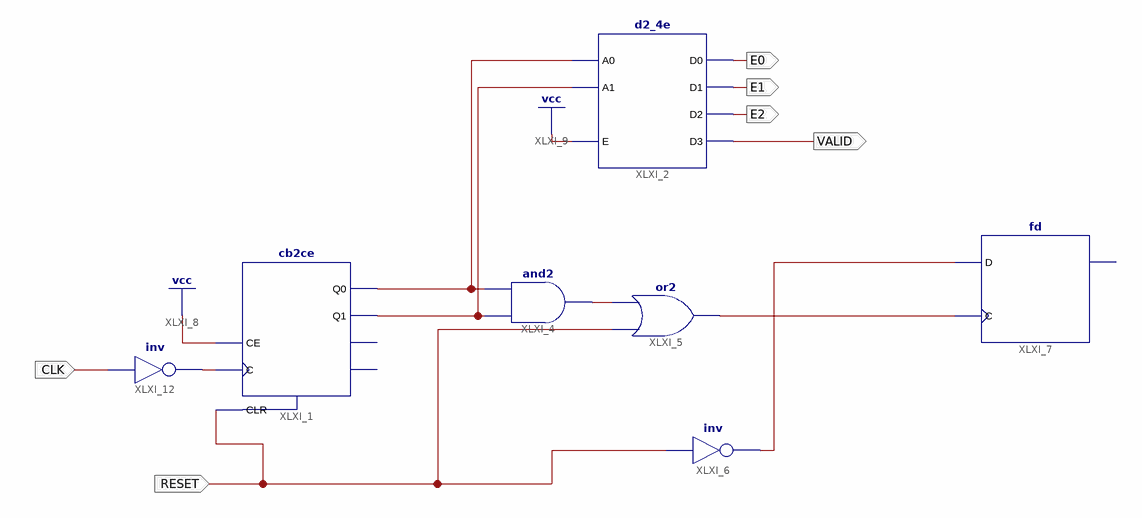
[diagram p0: schematic sheet 1]
// Xilinx ISE schematic mod3cnt.sch (spartan3) as structural Verilog: 7 symbols, 6 ports
module mod3cnt (
  input  RESET,
  input  CLK,
  output E0,
  output E1,
  output E2,
  output VALID
);

  wire XLXN_3, XLXN_4, XLXN_8, XLXN_14, XLXN_25, XLXN_35;

  d2_4e XLXI_2 (.A0(XLXN_3), .A1(XLXN_4), .E(1'b1), .D0(E0), .D1(E1), .D2(E2), .D3(VALID));
  cb2ce XLXI_1 (.C(XLXN_25), .CE(1'b1), .CLR(RESET), .Q0(XLXN_3), .Q1(XLXN_4));  // open: CEO, TC
  and XLXI_4 (XLXN_8, XLXN_4, XLXN_3);
  not XLXI_12 (XLXN_25, CLK);
  fd XLXI_7 (.C(XLXN_35), .D(XLXN_14));  // open: Q
  not XLXI_6 (XLXN_14, RESET);
  or XLXI_5 (XLXN_35, RESET, XLXN_8);
endmodule
